# Altium schematic sheet MP257_14x14.SchDoc: STM32MP257  I/Os
size A3; Date: Not used; ApprovedBy: Not used; CheckedBy: Not used; Author: Not used; CompanyName: STMicroelectronics; DrawnBy: Not used; Engineer: Not used; Organization: Not used; Address1: Not used; Address2: Not used; Address3: Not used; Address4: Not used; DocumentNumber: Not used; Revision: Not used; SheetNumber: 3; SheetTotal: 18; CurrentTime: Not used; CurrentDate: Not used; Time: Not used; DocumentFullPathAndName: Not used; DocumentName: Not used; ModifiedDate: Not used; ImagePath: Not used; ProjectName: Not used; Application_BuildNumber: Not used
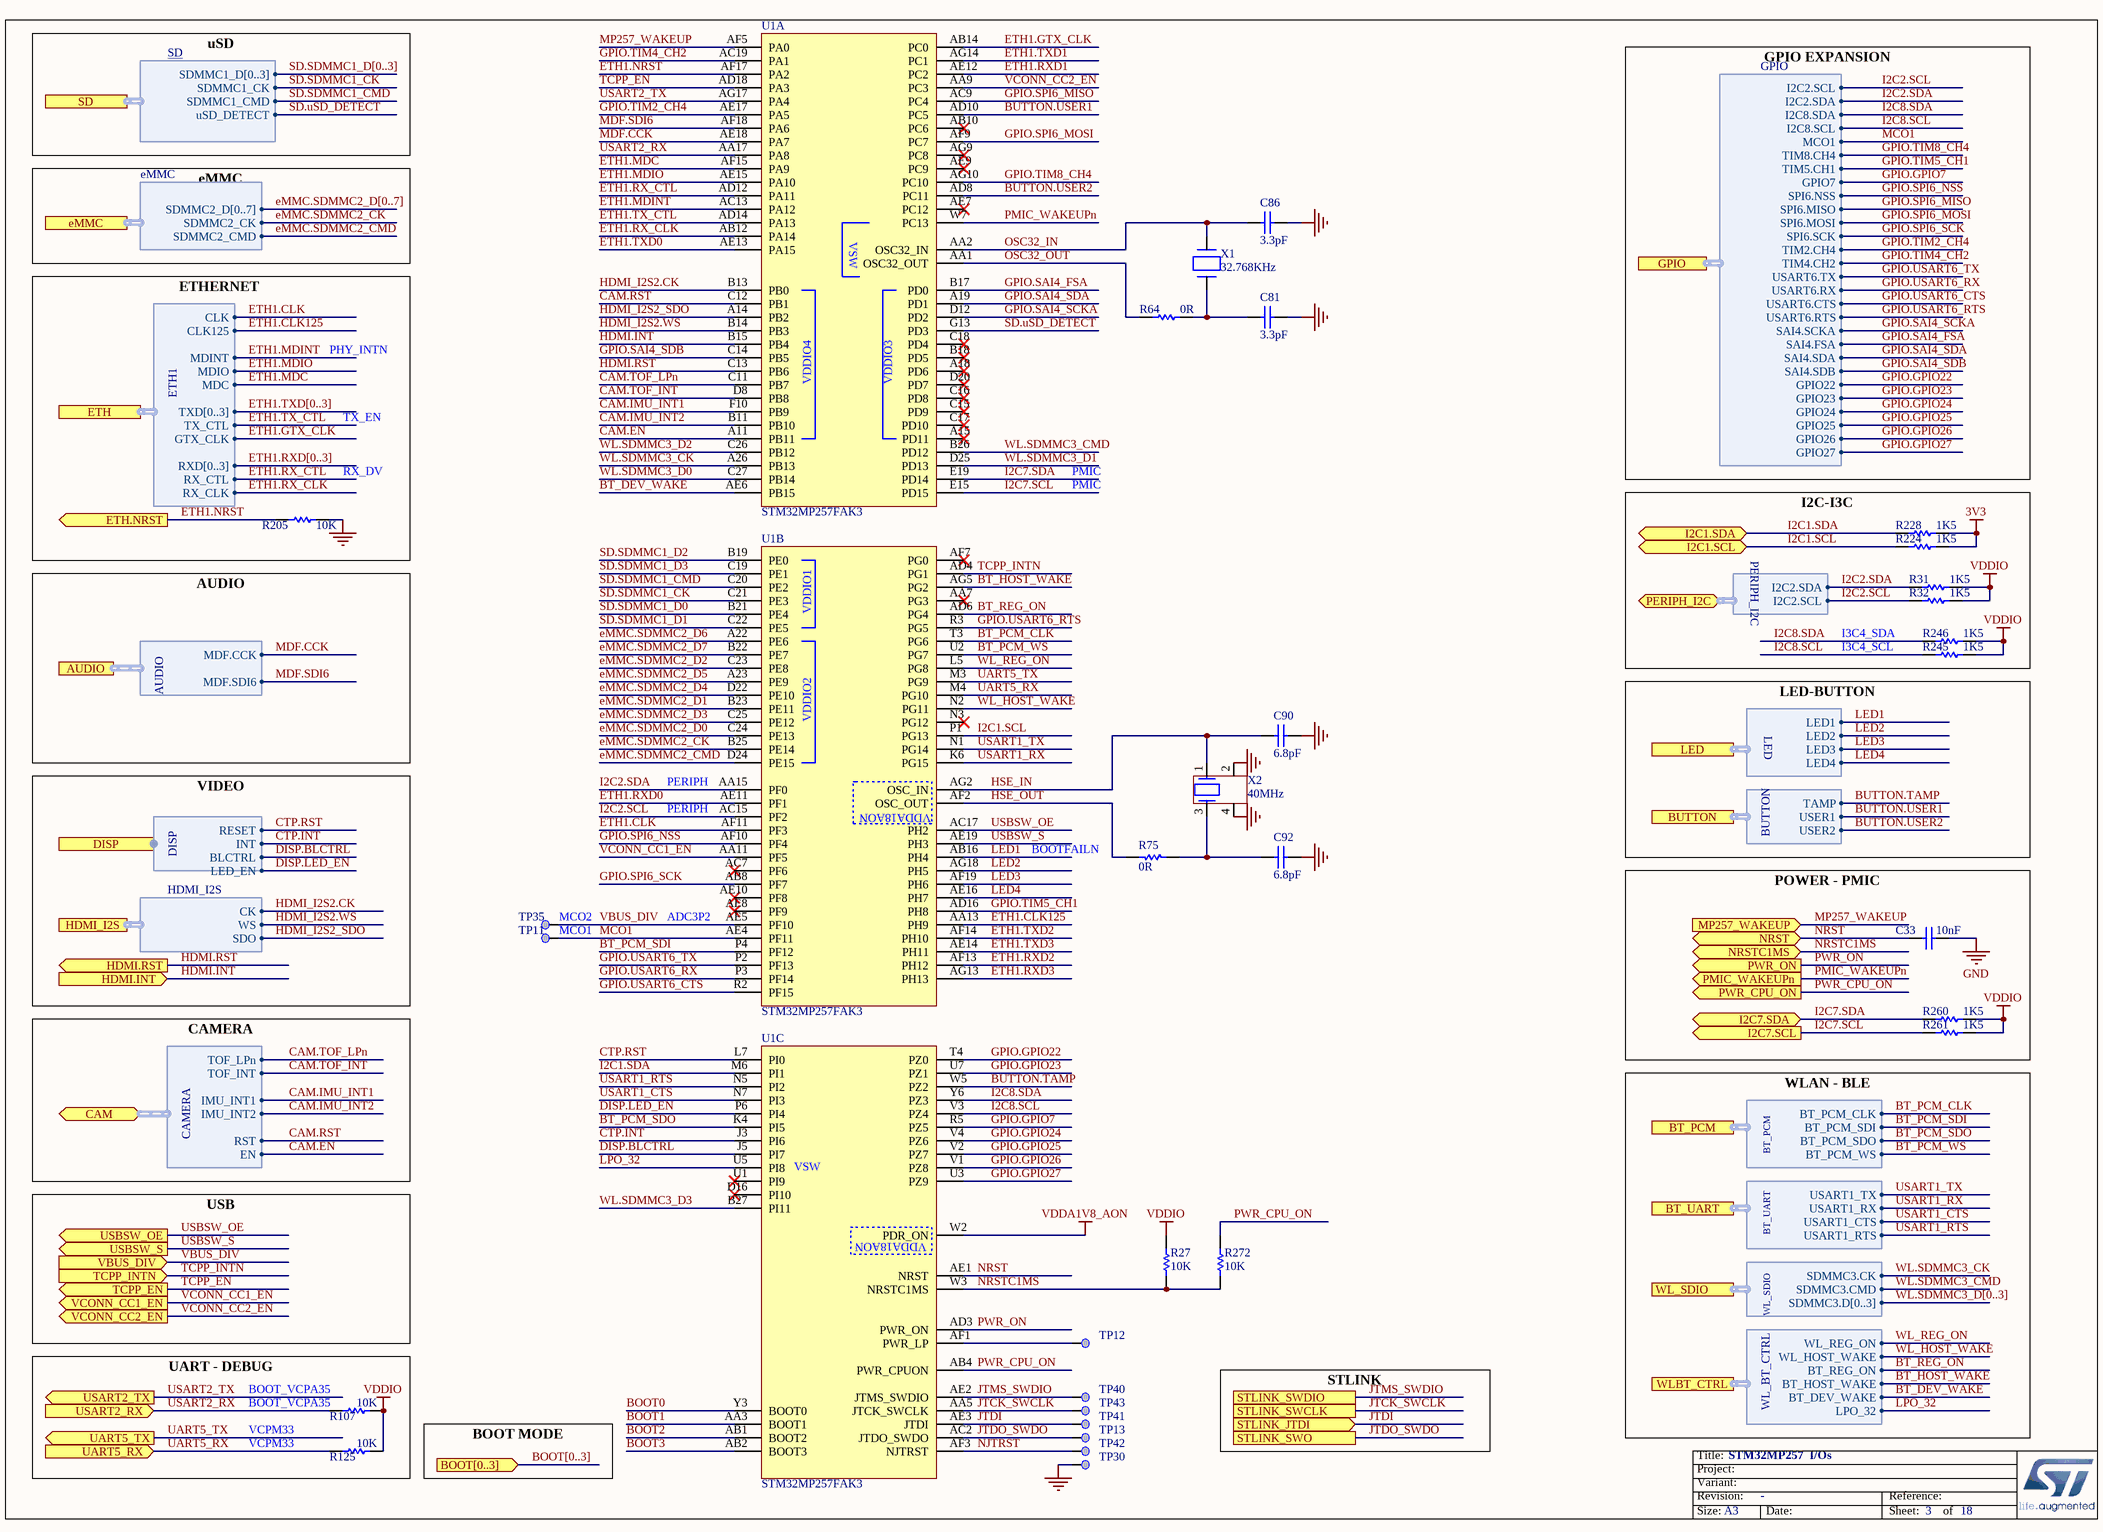
[diagram p0: MP257_14x14.SchDoc]

## Parts
C33  value 10nF  [C0402]  (hidden comment: Capacitor)
C81  value 3.3pF  [C0402]  (hidden comment: Capacitor)
C86  value 3.3pF  [C0402]  (hidden comment: Capacitor)
C90  value 6.8pF  [C0402]  (hidden comment: Capacitor)
C92  value 6.8pF  [C0402]  (hidden comment: Capacitor)
R27  value 10K  [R0402]  (hidden comment: Resistor)
R31  value 1K5  [R0402]  (hidden comment: Resistor)
R32  value 1K5  [R0402]  (hidden comment: Resistor)
R64  value 0R  [R0402]
R75  value 0R  [R0402]
R107  value 10K  [R0402]  (hidden comment: Resistor)
R125  value 10K  [R0402]  (hidden comment: Resistor)
R205  value 10K  [R0402]  (hidden comment: Resistor)
R224  value 1K5  [R0402]  (hidden comment: Resistor)
R228  value 1K5  [R0402]  (hidden comment: Resistor)
R245  value 1K5  [R0402]  (hidden comment: Resistor)
R246  value 1K5  [R0402]  (hidden comment: Resistor)
R260  value 1K5  [R0402]  (hidden comment: Resistor)
R261  value 1K5  [R0402]  (hidden comment: Resistor)
R272  value 10K  [R0402]  (hidden comment: Resistor)
TP11  Test Point  [TP_SMD_1MM]  (value not drawn)  (no BOM)
TP12  Test Point  [TP_SMD_1MM]  (value not drawn)  (no BOM)
TP13  Test Point  [TP_SMD_1MM]  (value not drawn)  (no BOM)
TP30  Test Point  [TP_SMD_1MM]  (value not drawn)  (no BOM)
TP35  Test Point  [TP_SMD_1MM]  (value not drawn)  (no BOM)
TP40  Test Point  [TP_SMD_1MM]  (value not drawn)  (no BOM)
TP41  Test Point  [TP_SMD_1MM]  (value not drawn)  (no BOM)
TP42  Test Point  [TP_SMD_1MM]  (value not drawn)  (no BOM)
TP43  Test Point  [TP_SMD_1MM]  (value not drawn)  (no BOM)
U1  STM32MP257FAK3  [ICC_TFBGA424_14X14_P050_H1P20_CODE-B0A2]  (parts A,B,C of 9)
X1  value 32.768KHz  [CRY_NX2012SA_2P]  (hidden comment: XTAL_2_PINS)
X2  value 40MHz  [CRY_NX1612SA_4P]  (hidden comment: XTAL_4_PINS)

## Ports
AUDIO (harness AUDIO), BOOT[0..3] (in), BT_PCM (harness BT_PCM), BT_UART (harness BT_UART), BUTTON (harness BUTTON), CAM (bidir, harness CAMERA), DISP (harness DISP), eMMC (harness eMMC), ETH (harness ETH1), ETH.NRST (out), GPIO (harness GPIO), HDMI.INT (in), HDMI.RST (out), HDMI_I2S (harness HDMI_I2S), I2C1.SCL (bidir), I2C1.SDA (bidir), I2C7.SCL (out), I2C7.SDA (bidir), LED (harness LED), MP257_WAKEUP (in), NRST (bidir), NRSTC1MS (bidir), PERIPH_I2C (bidir, harness PERIPH_I2C), PMIC_WAKEUPn (out), PWR_CPU_ON (out), PWR_ON (out), SD (harness SD), STLINK_JTDI (in), STLINK_SWCLK, STLINK_SWDIO, STLINK_SWO, TCPP_EN (out), TCPP_INTN (in), UART5_RX (in), UART5_TX (out), USART2_RX (in), USART2_TX (out), USBSW_OE (out), USBSW_S (out), VBUS_DIV (in), VCONN_CC1_EN (out), VCONN_CC2_EN (out), WL_SDIO (harness WL_SDIO), WLBT_CTRL (harness WL_BT_CTRL)

## Harnesses
ETH1: MDINT, CLK125, TXD[0..3], MDIO, MDC, RX_CLK, GTX_CLK, TX_CTL, RXD[0..3], RX_CTL, CLK
HDMI_I2S: CK, SDO, WS
GPIO: I2C2.SCL, I2C2.SDA, I2C8.SDA, MCO1, TIM8.CH4, TIM5.CH1, GPIO7, SPI6.NSS, SPI6.MISO, SPI6.MOSI, SPI6.SCK, TIM2.CH4, TIM4.CH2, USART6.TX, USART6.RX, USART6.CTS, USART6.RTS, I2C8.SCL, SAI4.SCKA, SAI4.FSA, SAI4.SDA, SAI4.SDB, GPIO22, GPIO23, GPIO24, GPIO25, GPIO26, GPIO27
PERIPH_I2C: I2C2.SDA, I2C2.SCL
LED: LED1, LED2, LED3, LED4
BUTTON: TAMP, USER1, USER2
CAMERA: TOF_LPn, TOF_INT, IMU_INT1, IMU_INT2, RST, EN
DISP: RESET, INT, BLCTRL, LED_EN
SD: SDMMC1_D[0..3], SDMMC1_CK, SDMMC1_CMD, uSD_DETECT
BT_PCM: BT_PCM_CLK, BT_PCM_SDI, BT_PCM_SDO, BT_PCM_WS
BT_UART: USART1_TX, USART1_RX, USART1_CTS, USART1_RTS
WL_SDIO: SDMMC3.CMD, SDMMC3.CK, SDMMC3.D[0..3]
WL_BT_CTRL: WL_REG_ON, WL_HOST_WAKE, BT_REG_ON, BT_HOST_WAKE, BT_DEV_WAKE, LPO_32
eMMC: SDMMC2_CK, SDMMC2_CMD, SDMMC2_D[0..7]
AUDIO: MDF.CCK, MDF.SDI6

## Nets
3V3: R224.2 R228.2
GND: C33.1 C81.2 C86.2 C90.1 C92.2 R205.2 TP30.1 X2.2 X2.4
VDDA1V8_AON: U1.W2(PDR_ON)
VDDIO: R27.2 R31.2 R32.2 R107.2 R125.2 R245.2 R246.2 R260.2 R261.2
BOOT0: U1.Y3(BOOT0)
BOOT1: U1.AA3(BOOT1)
BOOT2: U1.AB1(BOOT2)
BOOT3: U1.AB2(BOOT3)
BT_DEV_WAKE: U1.AE6(PB15) ; port WLBT_CTRL.BT_DEV_WAKE
BT_HOST_WAKE: U1.AG5(PG2) ; port WLBT_CTRL.BT_HOST_WAKE
BT_PCM_CLK: U1.T3(PG6) ; port BT_PCM.BT_PCM_CLK
BT_PCM_SDI: U1.P4(PF12) ; port BT_PCM.BT_PCM_SDI
BT_PCM_SDO: U1.K4(PI5) ; port BT_PCM.BT_PCM_SDO
BT_PCM_WS: U1.U2(PG7) ; port BT_PCM.BT_PCM_WS
BT_REG_ON: U1.AD6(PG4) ; port WLBT_CTRL.BT_REG_ON
BUTTON.TAMP: U1.W5(PZ2) ; port BUTTON.TAMP
BUTTON.USER1: U1.AD10(PC5) ; port BUTTON.USER1
BUTTON.USER2: U1.AD8(PC11) ; port BUTTON.USER2
CAM.EN: U1.A11(PB11) ; port CAM.EN
CAM.IMU_INT1: U1.F10(PB9) ; port CAM.IMU_INT1
CAM.IMU_INT2: U1.B11(PB10) ; port CAM.IMU_INT2
CAM.RST: U1.C12(PB1) ; port CAM.RST
CAM.TOF_INT: U1.D8(PB8) ; port CAM.TOF_INT
CAM.TOF_LPn: U1.C11(PB7) ; port CAM.TOF_LPn
CTP.INT: U1.J3(PI6) ; port DISP.INT
CTP.RST: U1.L7(PI0) ; port DISP.RESET
DISP.BLCTRL: U1.J5(PI7) ; port DISP.BLCTRL
DISP.LED_EN: U1.P6(PI4) ; port DISP.LED_EN
eMMC.SDMMC2_CK: U1.B25(PE14) ; port eMMC.SDMMC2_CK
eMMC.SDMMC2_CMD: U1.D24(PE15) ; port eMMC.SDMMC2_CMD
eMMC.SDMMC2_D0: U1.C24(PE13)
eMMC.SDMMC2_D1: U1.B23(PE11)
eMMC.SDMMC2_D2: U1.C23(PE8)
eMMC.SDMMC2_D3: U1.C25(PE12)
eMMC.SDMMC2_D4: U1.D22(PE10)
eMMC.SDMMC2_D5: U1.A23(PE9)
eMMC.SDMMC2_D6: U1.A22(PE6)
eMMC.SDMMC2_D7: U1.B22(PE7)
ETH1.CLK: U1.AF11(PF3) ; port ETH.CLK
ETH1.CLK125: U1.AA13(PH9) ; port ETH.CLK125
ETH1.GTX_CLK: U1.AB14(PC0) ; port ETH.GTX_CLK
ETH1.MDC: U1.AF15(PA9) ; port ETH.MDC
ETH1.MDINT: U1.AC13(PA12) ; port ETH.MDINT
ETH1.MDIO: U1.AE15(PA10) ; port ETH.MDIO
ETH1.NRST: R205.1 U1.AF17(PA2) ; port ETH.NRST
ETH1.RX_CLK: U1.AB12(PA14) ; port ETH.RX_CLK
ETH1.RX_CTL: U1.AD12(PA11) ; port ETH.RX_CTL
ETH1.RXD0: U1.AE11(PF1)
ETH1.RXD1: U1.AE12(PC2)
ETH1.RXD2: U1.AF13(PH12)
ETH1.RXD3: U1.AG13(PH13)
ETH1.TX_CTL: U1.AD14(PA13) ; port ETH.TX_CTL
ETH1.TXD0: U1.AE13(PA15)
ETH1.TXD1: U1.AG14(PC1)
ETH1.TXD2: U1.AF14(PH10)
ETH1.TXD3: U1.AE14(PH11)
GPIO.GPIO7: U1.R5(PZ5) ; port GPIO.GPIO7
GPIO.GPIO22: U1.T4(PZ0) ; port GPIO.GPIO22
GPIO.GPIO23: U1.U7(PZ1) ; port GPIO.GPIO23
GPIO.GPIO24: U1.V4(PZ6) ; port GPIO.GPIO24
GPIO.GPIO25: U1.V2(PZ7) ; port GPIO.GPIO25
GPIO.GPIO26: U1.V1(PZ8) ; port GPIO.GPIO26
GPIO.GPIO27: U1.U3(PZ9) ; port GPIO.GPIO27
GPIO.SAI4_FSA: U1.B17(PD0) ; port GPIO.SAI4.FSA
GPIO.SAI4_SCKA: U1.D12(PD2) ; port GPIO.SAI4.SCKA
GPIO.SAI4_SDA: U1.A19(PD1) ; port GPIO.SAI4.SDA
GPIO.SAI4_SDB: U1.C14(PB5) ; port GPIO.SAI4.SDB
GPIO.SPI6_MISO: U1.AC9(PC4) ; port GPIO.SPI6.MISO
GPIO.SPI6_MOSI: U1.AF9(PC7) ; port GPIO.SPI6.MOSI
GPIO.SPI6_NSS: U1.AF10(PF4) ; port GPIO.SPI6.NSS
GPIO.SPI6_SCK: U1.AB8(PF7) ; port GPIO.SPI6.SCK
GPIO.TIM2_CH4: U1.AE17(PA5) ; port GPIO.TIM2.CH4
GPIO.TIM4_CH2: U1.AC19(PA1) ; port GPIO.TIM4.CH2
GPIO.TIM5_CH1: U1.AD16(PH8) ; port GPIO.TIM5.CH1
GPIO.TIM8_CH4: U1.AG10(PC10) ; port GPIO.TIM8.CH4
GPIO.USART6_CTS: U1.R2(PF15) ; port GPIO.USART6.CTS
GPIO.USART6_RTS: U1.R3(PG5) ; port GPIO.USART6.RTS
GPIO.USART6_RX: U1.P3(PF14) ; port GPIO.USART6.RX
GPIO.USART6_TX: U1.P2(PF13) ; port GPIO.USART6.TX
HDMI.INT: U1.B15(PB4) ; port HDMI.INT
HDMI.RST: U1.C13(PB6) ; port HDMI.RST
HDMI_I2S2.CK: U1.B13(PB0) ; port HDMI_I2S.CK
HDMI_I2S2.WS: U1.B14(PB3) ; port HDMI_I2S.WS
HDMI_I2S2_SDO: U1.A14(PB2) ; port HDMI_I2S.SDO
HSE_IN: C90.2 U1.AG2(OSC_IN) X2.1
HSE_OUT: R75.2 U1.AF2(OSC_OUT)
I2C1.SCL: R224.1 U1.P1(PG13) ; port I2C1.SCL
I2C1.SDA: R228.1 U1.M6(PI1) ; port I2C1.SDA
I2C2.SCL: R32.1 U1.AC15(PF2) ; port GPIO.I2C2.SCL, port PERIPH_I2C.I2C2.SCL
I2C2.SDA: R31.1 U1.AA15(PF0) ; port GPIO.I2C2.SDA, port PERIPH_I2C.I2C2.SDA
I2C7.SCL: R261.1 U1.E15(PD15) ; port I2C7.SCL
I2C7.SDA: R260.1 U1.E19(PD14) ; port I2C7.SDA
I2C8.SCL: R245.1 U1.V3(PZ4) ; port GPIO.I2C8.SCL
I2C8.SDA: R246.1 U1.Y6(PZ3) ; port GPIO.I2C8.SDA
JTCK_SWCLK: TP43.1 U1.AA5(JTCK_SWCLK) ; port STLINK_SWCLK
JTDI: TP41.1 U1.AE3(JTDI) ; port STLINK_JTDI
JTDO_SWDO: TP13.1 U1.AC2(JTDO_SWDO) ; port STLINK_SWO
JTMS_SWDIO: TP40.1 U1.AE2(JTMS_SWDIO) ; port STLINK_SWDIO
LED1: U1.AB16(PH4) ; port LED.LED1
LED2: U1.AG18(PH5) ; port LED.LED2
LED3: U1.AF19(PH6) ; port LED.LED3
LED4: U1.AE16(PH7) ; port LED.LED4
LPO_32: U1.U5(PI8) ; port WLBT_CTRL.LPO_32
MCO1: TP11.1 U1.AE4(PF11) ; port GPIO.MCO1
MDF.CCK: U1.AE18(PA7) ; port AUDIO.MDF.CCK
MDF.SDI6: U1.AF18(PA6) ; port AUDIO.MDF.SDI6
MP257_WAKEUP: U1.AF5(PA0) ; port MP257_WAKEUP
NJTRST: TP42.1 U1.AF3(NJTRST)
NRST: C33.2 U1.AE1(NRST) ; port NRST
NRSTC1MS: R27.1 R272.1 U1.W3(NRSTC1MS) ; port NRSTC1MS
OSC32_IN: C86.1 U1.AA2(OSC32_IN) X1.2(X2)
OSC32_OUT: R64.1 U1.AA1(OSC32_OUT)
PMIC_WAKEUPn: U1.W7(PC13) ; port PMIC_WAKEUPn
PWR_CPU_ON: R272.2 U1.AB4(PWR_CPUON) ; port PWR_CPU_ON
PWR_ON: U1.AD3(PWR_ON) ; port PWR_ON
SD.SDMMC1_CK: U1.C21(PE3) ; port SD.SDMMC1_CK
SD.SDMMC1_CMD: U1.C20(PE2) ; port SD.SDMMC1_CMD
SD.SDMMC1_D0: U1.B21(PE4)
SD.SDMMC1_D1: U1.C22(PE5)
SD.SDMMC1_D2: U1.B19(PE0)
SD.SDMMC1_D3: U1.C19(PE1)
SD.uSD_DETECT: U1.G13(PD3) ; port SD.uSD_DETECT
TCPP_EN: U1.AD18(PA3) ; port TCPP_EN
TCPP_INTN: U1.AD4(PG1) ; port TCPP_INTN
UART5_RX: R125.1 U1.M4(PG10) ; port UART5_RX
UART5_TX: U1.M3(PG9) ; port UART5_TX
USART1_CTS: U1.N7(PI3) ; port BT_UART.USART1_CTS
USART1_RTS: U1.N5(PI2) ; port BT_UART.USART1_RTS
USART1_RX: U1.K6(PG15) ; port BT_UART.USART1_RX
USART1_TX: U1.N1(PG14) ; port BT_UART.USART1_TX
USART2_RX: R107.1 U1.AA17(PA8) ; port USART2_RX
USART2_TX: U1.AG17(PA4) ; port USART2_TX
USBSW_OE: U1.AC17(PH2) ; port USBSW_OE
USBSW_S: U1.AE19(PH3) ; port USBSW_S
VBUS_DIV: TP35.1 U1.AE5(PF10) ; port VBUS_DIV
VCONN_CC1_EN: U1.AA11(PF5) ; port VCONN_CC1_EN
VCONN_CC2_EN: U1.AA9(PC3) ; port VCONN_CC2_EN
WL.SDMMC3_CK: U1.A26(PB13) ; port WL_SDIO.SDMMC3.CK
WL.SDMMC3_CMD: U1.B26(PD12) ; port WL_SDIO.SDMMC3.CMD
WL.SDMMC3_D0: U1.C27(PB14)
WL.SDMMC3_D1: U1.D25(PD13)
WL.SDMMC3_D2: U1.C26(PB12)
WL.SDMMC3_D3: U1.B27(PI11)
WL_HOST_WAKE: U1.N2(PG11) ; port WLBT_CTRL.WL_HOST_WAKE
WL_REG_ON: U1.L5(PG8) ; port WLBT_CTRL.WL_REG_ON
NetC81_1: C81.1 R64.2 X1.1(X1)
NetC92_1: C92.1 R75.1 X2.3
NetTP12_1: TP12.1 U1.AF1(PWR_LP)

Not connected (* = marked no-connect by the designer): U1 A15(PD11)* A18(PD6)* AA7(PG3)* AB10(PC6)* AC7(PF6)* AE7(PC12)* AE8(PF9)* AE9(PC9)* AE10(PF8)* AF7(PG0)* AG9(PC8)* B18(PD5)* C15(PD9)* C16(PD8)* C17(PD10)* C18(PD4)* D16(PI10)* D20(PD7)* N3(PG12)* U1(PI9)*

## Buses and harness runs
bus BOOT[0..3] = port BOOT[0..3]
bus eMMC.SDMMC2_D[0..7]
bus ETH1.RXD[0..3]
bus ETH1.TXD[0..3]
bus SD.SDMMC1_D[0..3]
bus WL.SDMMC3_D[0..3]

## Notes on the sheet
- uSD
- eMMC
- PHY_INTN
- TX_EN
- (near R205) RX_DV
- PMIC
- GPIO EXPANSION
- (near R205) ETHERNET
- I2C-I3C
- I3C4_SDA
- I3C4_SCL
- AUDIO
- PERIPH
- (near R75) BOOTFAILN
- LED-BUTTON
- MCO2
- MCO1
- ADC3P2
- VIDEO
- POWER - PMIC
- CAMERA
- USB
- (near R107) BOOT_VCPA35
- UART - DEBUG
- VCPM33
- BOOT MODE
- STLINK
- WLAN - BLE
- Title:
- Project:
- Size:
- Revision:
- Variant:
- A3
- -
- Date:
- Reference:
- Sheet:
- of
- (in symbol MCD-03375, part A) VSW
- (in symbol MCD-03375, part C) VSW

## Library data of the parts
C33 = MCD-00011: Capacitor, MLCC, 10nF, 16V, X7R, 10%, 0402, T=0.5mm; Manufacturer_Part_Number: CC0402KRX7R7BB103; Manufacturer: YAGEO; Provided_By: SUBCO; Initial_Board_Reference: MB1274; Internal_Part_Number: MCD-00011; Status: Released; Part_Type: Capacitor; Package: C0402; ComponentLink1Description: Datasheet; ComponentLink1URL: http://tunmcdsvn.tun.st.com/Component_Datasheet_Library/Trunk/Capacitors/Yageo_Multilayer_Capacitor_X7R_series_100pF_to_22uF; ECCN_US: n/a; ECCN_EU: n/a
C81 C86 = MCD-01775: Capacitor, MLCC, 3.3pF, 50V, NPO, +/-0.1pF, 0402, T=0.5mm; Part_Preference: Recommended; Manufacturer: YAGEO; Manufacturer_Part_Number: CC0402BRNPO9BN3R3; Component_Country_Of_Origin: China; ShowFields: YES; ID: 3875; Internal_Part_Number: MCD-01775; Status: Released; Part_Type: Capacitor; Package: 0402; ComponentLink1URL: http://tunmcdsvn.tun.st.com/Component_Documentation_Library/Trunk/Capacitor/YAGEO_NP0_Series; Order_Code_Digikey: 311-1621-1-ND; Order_Code_Farnell: N/A; Order_Code_RS: N/A
C90 C92 = MCD-00674: Capacitor, MLCC, 6.8pF, 50V, NPO, +-0.25pF, 0402, T=0.5mm; Manufacturer_Part_Number: CC0402CRNPO9BN6R8; Manufacturer: YAGEO; Part_Preference: Recommended; Provided_By: SUBCO; Initial_Board_Reference: MB1319; Component_Country_Of_Origin: China; ID: 3068; ShowFields: YES; Internal_Part_Number: MCD-00674; Status: Released; Part_Type: Capacitor; Package: 0402; ComponentLink1Description: Datasheet; ComponentLink1URL: http://tunmcdsvn.tun.st.com/Component_Documentation_Library/Trunk/Capacitor/YAGEO_NP0_Series; ECCN_US: n/a; ECCN_EU: n/a; Alternate_Manufacturer: N/A; Alternate_Manufacturer_Part_Number: N/A; Order_Code_Digikey: 311-3327-1-ND; Order_Code_Farnell: N/A; Order_Code_RS: N/A
R27 R107 R125 R272 = MCD-00053: Resistor,10K,0402,1%,1/16W; BMS_Part_Number: 9131590; Part_Preference: Recommended; Manufacturer: YAGEO; Manufacturer_Part_Number: RC0402FR-0710KL; Component_Country_Of_Origin: China; ID: 2539; ShowFields: YES; Internal_Part_Number: MCD-00053; Status: Released; Part_Type: Resistor; Package: 0402; ComponentLink1Description: Datasheet; ComponentLink1URL: http://tunmcdsvn.tun.st.com/Component_Documentation_Library/Trunk/Resistor/YAGEO_RC_L_Series; Order_Code_Digikey: 311-10.0KLRCT-ND; Order_Code_Farnell: 9239359; Order_Code_RS: N/A; Alternate_Manufacturer: N/A; Alternate_Manufacturer_Part_Number: N/A
R31 R32 R224 R228 R245 R246 R260 R261 = MCD-00068: Resistor,1K5,0402,1%,1/16W; Part_Preference: Recommended; Manufacturer: YAGEO; Manufacturer_Part_Number: RC0402FR-071K5L; Component_Country_Of_Origin: China; ID: 2524; ShowFields: YES; Internal_Part_Number: MCD-00068; Status: Released; Part_Type: Resistor; Package: 0402; ComponentLink1Description: Datasheet; ComponentLink1URL: http://tunmcdsvn.tun.st.com/Component_Documentation_Library/Trunk/Resistor/YAGEO_RC_L_Series; Order_Code_Digikey: 311-1.50KLRCT-ND; Order_Code_Farnell: 9239251; Order_Code_RS: N/A
  R31 R32 R224 R228 R245 R246: Alternate_Manufacturer: N/A; Alternate_Manufacturer_Part_Number: N/A
R64 R75 = MCD-00052: Resistor,0R,0402,5%,1/16W; Manufacturer_Part_Number: RC0402JR-070RL; Manufacturer: YAGEO; Part_Preference: Recommended; Provided_By: SUBCO; Initial_Board_Reference: mb1274; Order_Code_RS: 618-5804; Component_Country_Of_Origin: China; ID: 2540; ShowFields: YES; Internal_Part_Number: MCD-00052; ComponentLink1Description: Datasheet; ECCN_US: n/a; ECCN_EU: n/a; Status: Released; Part_Type: Resistor; ComponentLink1URL: http://tunmcdsvn.tun.st.com/Component_Documentation_Library/Trunk/Resistor/YAGEO_RC_L_Series; Package: 0402; Alternate_Manufacturer: N/A; Alternate_Manufacturer_Part_Number: N/A; Order_Code_Digikey: 311-0.0JRCT-ND; Order_Code_Farnell: 9232516RL
R205 = MCD-00053: Resistor,10K,0402,1%,1/16W; Manufacturer_Part_Number: RC0402FR-0710KL; Manufacturer: YAGEO; BMS_Part_Number: 9131590; Part_Preference: Recommended; Component_Country_Of_Origin: China; ID: 2539; ShowFields: YES; Internal_Part_Number: MCD-00053; ComponentLink1Description: Datasheet; Status: Released; Part_Type: Resistor; ComponentLink1URL: http://tunmcdsvn.tun.st.com/Component_Documentation_Library/Trunk/Resistor/YAGEO_RC_L_Series; Package: 0402; Order_Code_Digikey: 311-10.0KLRCT-ND; Order_Code_Farnell: 9239359; Order_Code_RS: N/A; Alternate_Manufacturer: N/A; Alternate_Manufacturer_Part_Number: N/A
TP11-TP13 TP30 TP35 TP40-TP43 = MCD-00074: Test Point 1mm; Part_Type: Misc; Part_Preference: Recommended; Initial_Board_Reference: MB1274; ID: 2518; ShowFields: YES; Internal_Part_Number: MCD-00074; Status: Released; Manufacturer_Part_Number: n/a; Manufacturer: n/a; ComponentLink1Description: Datasheet; ComponentLink1URL: http://na; ECCN_US: n/a; ECCN_EU: n/a; Provided_By: n/a; Order_Code_Digikey: N/A; Order_Code_Farnell: N/A; Order_Code_RS: N/A
U1 = MCD-03375: MPU , 2xCortex-A35@1.5GHz, Cortex-M33@400MHz, TFBGA 14x14, pitch 0.5, 648KB SRAM, With Crypto; Part_Type: IC; Part_Preference: Recommended; Manufacturer: STMICROELECTRONICS; Component_Country_Of_Origin: Unknown; ShowFields: YES; ID: 5491; Value: STM32MP257FAK3; Internal_Part_Number: MCD-03375; Status: Checked; Manufacturer_Part_Number: STM32MP257FAK3; Package: TFBGA; ComponentLink1URL: http://tunmcdsvn.tun.st.com/Component_Documentation_Library/Trunk/IC/STMICROELECTRONICS_STM32MP257FAK3; Order_Code_Digikey: N/A; Order_Code_Farnell: N/A; Order_Code_RS: N/A
X1 = MCD-01479: Crystal, 32.768kHz, 6pF, +/-20ppm, 80K, 2.05x1.2mm; BMS_Part_Number: 9157049; Part_Type: Crystal_Osc; Part_Preference: Recommended; Manufacturer: NDK; Manufacturer_Part_Number: NX2012SA-32.768KHZ-EXS00A-MU00527; Component_Country_Of_Origin: Unknown; ShowFields: YES; ID: 3579; Internal_Part_Number: MCD-01479; Status: Released; Package: 2.05x1.2mm; ComponentLink1URL: http://tunmcdsvn.tun.st.com/Component_Documentation_Library/Trunk/Crytal_Oscillator/NDK_NX2012SA_Series; Order_Code_Digikey: 644-1352; Order_Code_Farnell: N/A; Order_Code_RS: N/A
X2 = MCD-02344: Crystal, 40MHz, 6pF, +/-20ppm, 80R, 1.6x1.2mm; Part_Type: Crystal_Osc; Part_Preference: Recommended; Manufacturer: NDK; Manufacturer_Part_Number: NX1612SA-40MHZ-EXS00A-CS13836; Component_Country_Of_Origin: Unknown; ShowFields: YES; ID: 4450; Internal_Part_Number: MCD-02344; Status: Checked; Package: 1.6x1.2mm; ComponentLink1URL: http://tunmcdsvn.tun.st.com/Component_Documentation_Library/Trunk/Crytal_Oscillator/NDK_NX1612SA_Series/; Order_Code_Digikey: N/A; Order_Code_Farnell: N/A; Order_Code_RS: N/A